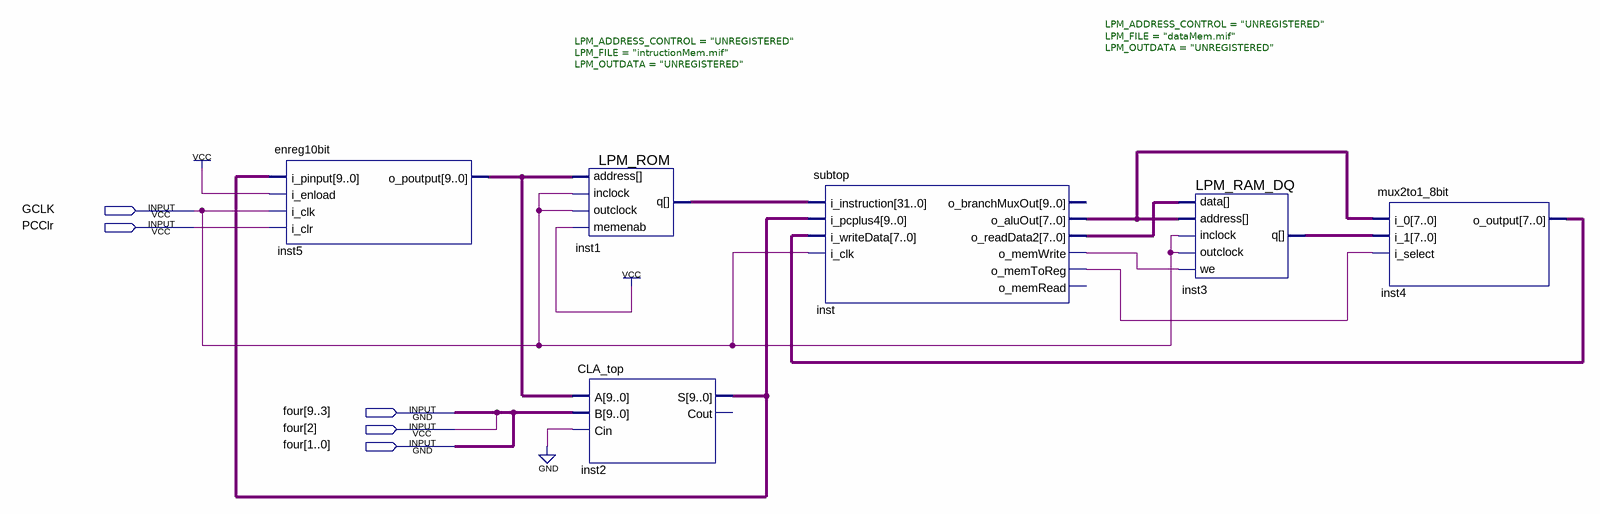
[diagram p0: schematic sheet]
// Quartus schematic mips_processor.bdf as structural Verilog: 6 symbols, 5 pins
module mips_processor (
  input  GCLK,
  input  PCClr,
  input  [9:0] four
);

  wire inst_o_memtoreg, inst_o_memwrite;
  wire [7:0] inst3_q, inst4_o_output, inst_o_aluout, inst_o_readdata2;
  wire [9:0] inst2_s, inst5_o_poutput;
  wire [31:0] inst1_q;

  enreg10bit inst5 (.i_pinput(inst2_s), .i_enload(1'b1), .i_clk(GCLK), .i_clr(PCClr), .o_poutput(inst5_o_poutput));
  LPM_ROM #(.LPM_ADDRESS_CONTROL("UNREGISTERED"), .LPM_FILE("intructionMem.mif"), .LPM_OUTDATA("UNREGISTERED")) inst1 (
    .address(inst5_o_poutput), .inclock(GCLK), .outclock(GCLK), .memenab(1'b1), .q(inst1_q));
  CLA_top inst2 (.A(inst5_o_poutput), .B({four[9:3], four[1:0]}), .Cin(1'b0), .S(inst2_s));  // open: Cout
  subtop inst (
    .i_instruction(inst1_q), .i_pcplus4(inst2_s), .i_writeData(inst4_o_output), .i_clk(GCLK),
    .o_aluOut(inst_o_aluout), .o_readData2(inst_o_readdata2), .o_memWrite(inst_o_memwrite),
    .o_memToReg(inst_o_memtoreg));  // open: o_branchMuxOut, o_memRead
  LPM_RAM_DQ #(.LPM_ADDRESS_CONTROL("UNREGISTERED"), .LPM_FILE("dataMem.mif"), .LPM_OUTDATA("UNREGISTERED")) inst3 (
    .inclock(GCLK), .data(inst_o_readdata2), .address(inst_o_aluout), .we(inst_o_memwrite), .outclock(GCLK),
    .q(inst3_q));
  mux2to1_8bit inst4 (.i_0(inst_o_aluout), .i_1(inst3_q), .i_select(inst_o_memtoreg), .o_output(inst4_o_output));
endmodule
